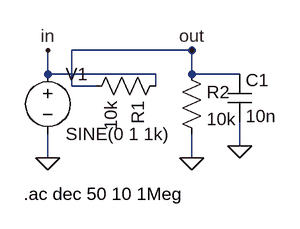
[diagram p0: schematic shelf.asc]
shelf.asc, the LTspice schematic file:
Version 4
SHEET 1 880 680
WIRE 128 80 272 80
WIRE 272 80 272 96
WIRE 128 80 128 48
WIRE 192 96 160 96
WIRE 160 96 160 48
WIRE 160 48 320 48
WIRE 320 48 320 80
WIRE 320 80 320 48
WIRE 384 80 320 80
WIRE 320 160 320 192
WIRE 384 144 384 176
WIRE 128 160 128 192
FLAG 128 48 in
FLAG 320 48 out
FLAG 320 192 0
FLAG 384 176 0
FLAG 128 192 0
SYMBOL voltage 128 64 R0
SYMATTR InstName V1
SYMATTR Value SINE(0 1 1k)
SYMATTR Value2 AC 1
SYMBOL res 288 80 R90
SYMATTR InstName R1
SYMATTR Value 10k
SYMBOL res 304 64 R0
SYMATTR InstName R2
SYMATTR Value 10k
SYMBOL cap 368 80 R0
SYMATTR InstName C1
SYMATTR Value 10n
TEXT 96 240 Left 2 !.ac dec 50 10 1Meg

The netlist it stands for:
* shelf.asc
V1 in 0 SINE(0 1 1k) AC 1
R1 in out 10k
R2 out 0 10k
C1 out 0 10n
.ac dec 50 10 1Meg
.backanno
.end